# EasyEDA Pro project Clock2.eprj

# Schematic Schematic1
Board Name: Board1; Create Date: 2026-04-25; Page Name: P1; Project Name: Clock2; Schematic Name: Schematic1; Update Date: 2026-04-26; Company: EasyEDA.com; Page Size: A4; Version: V1.0
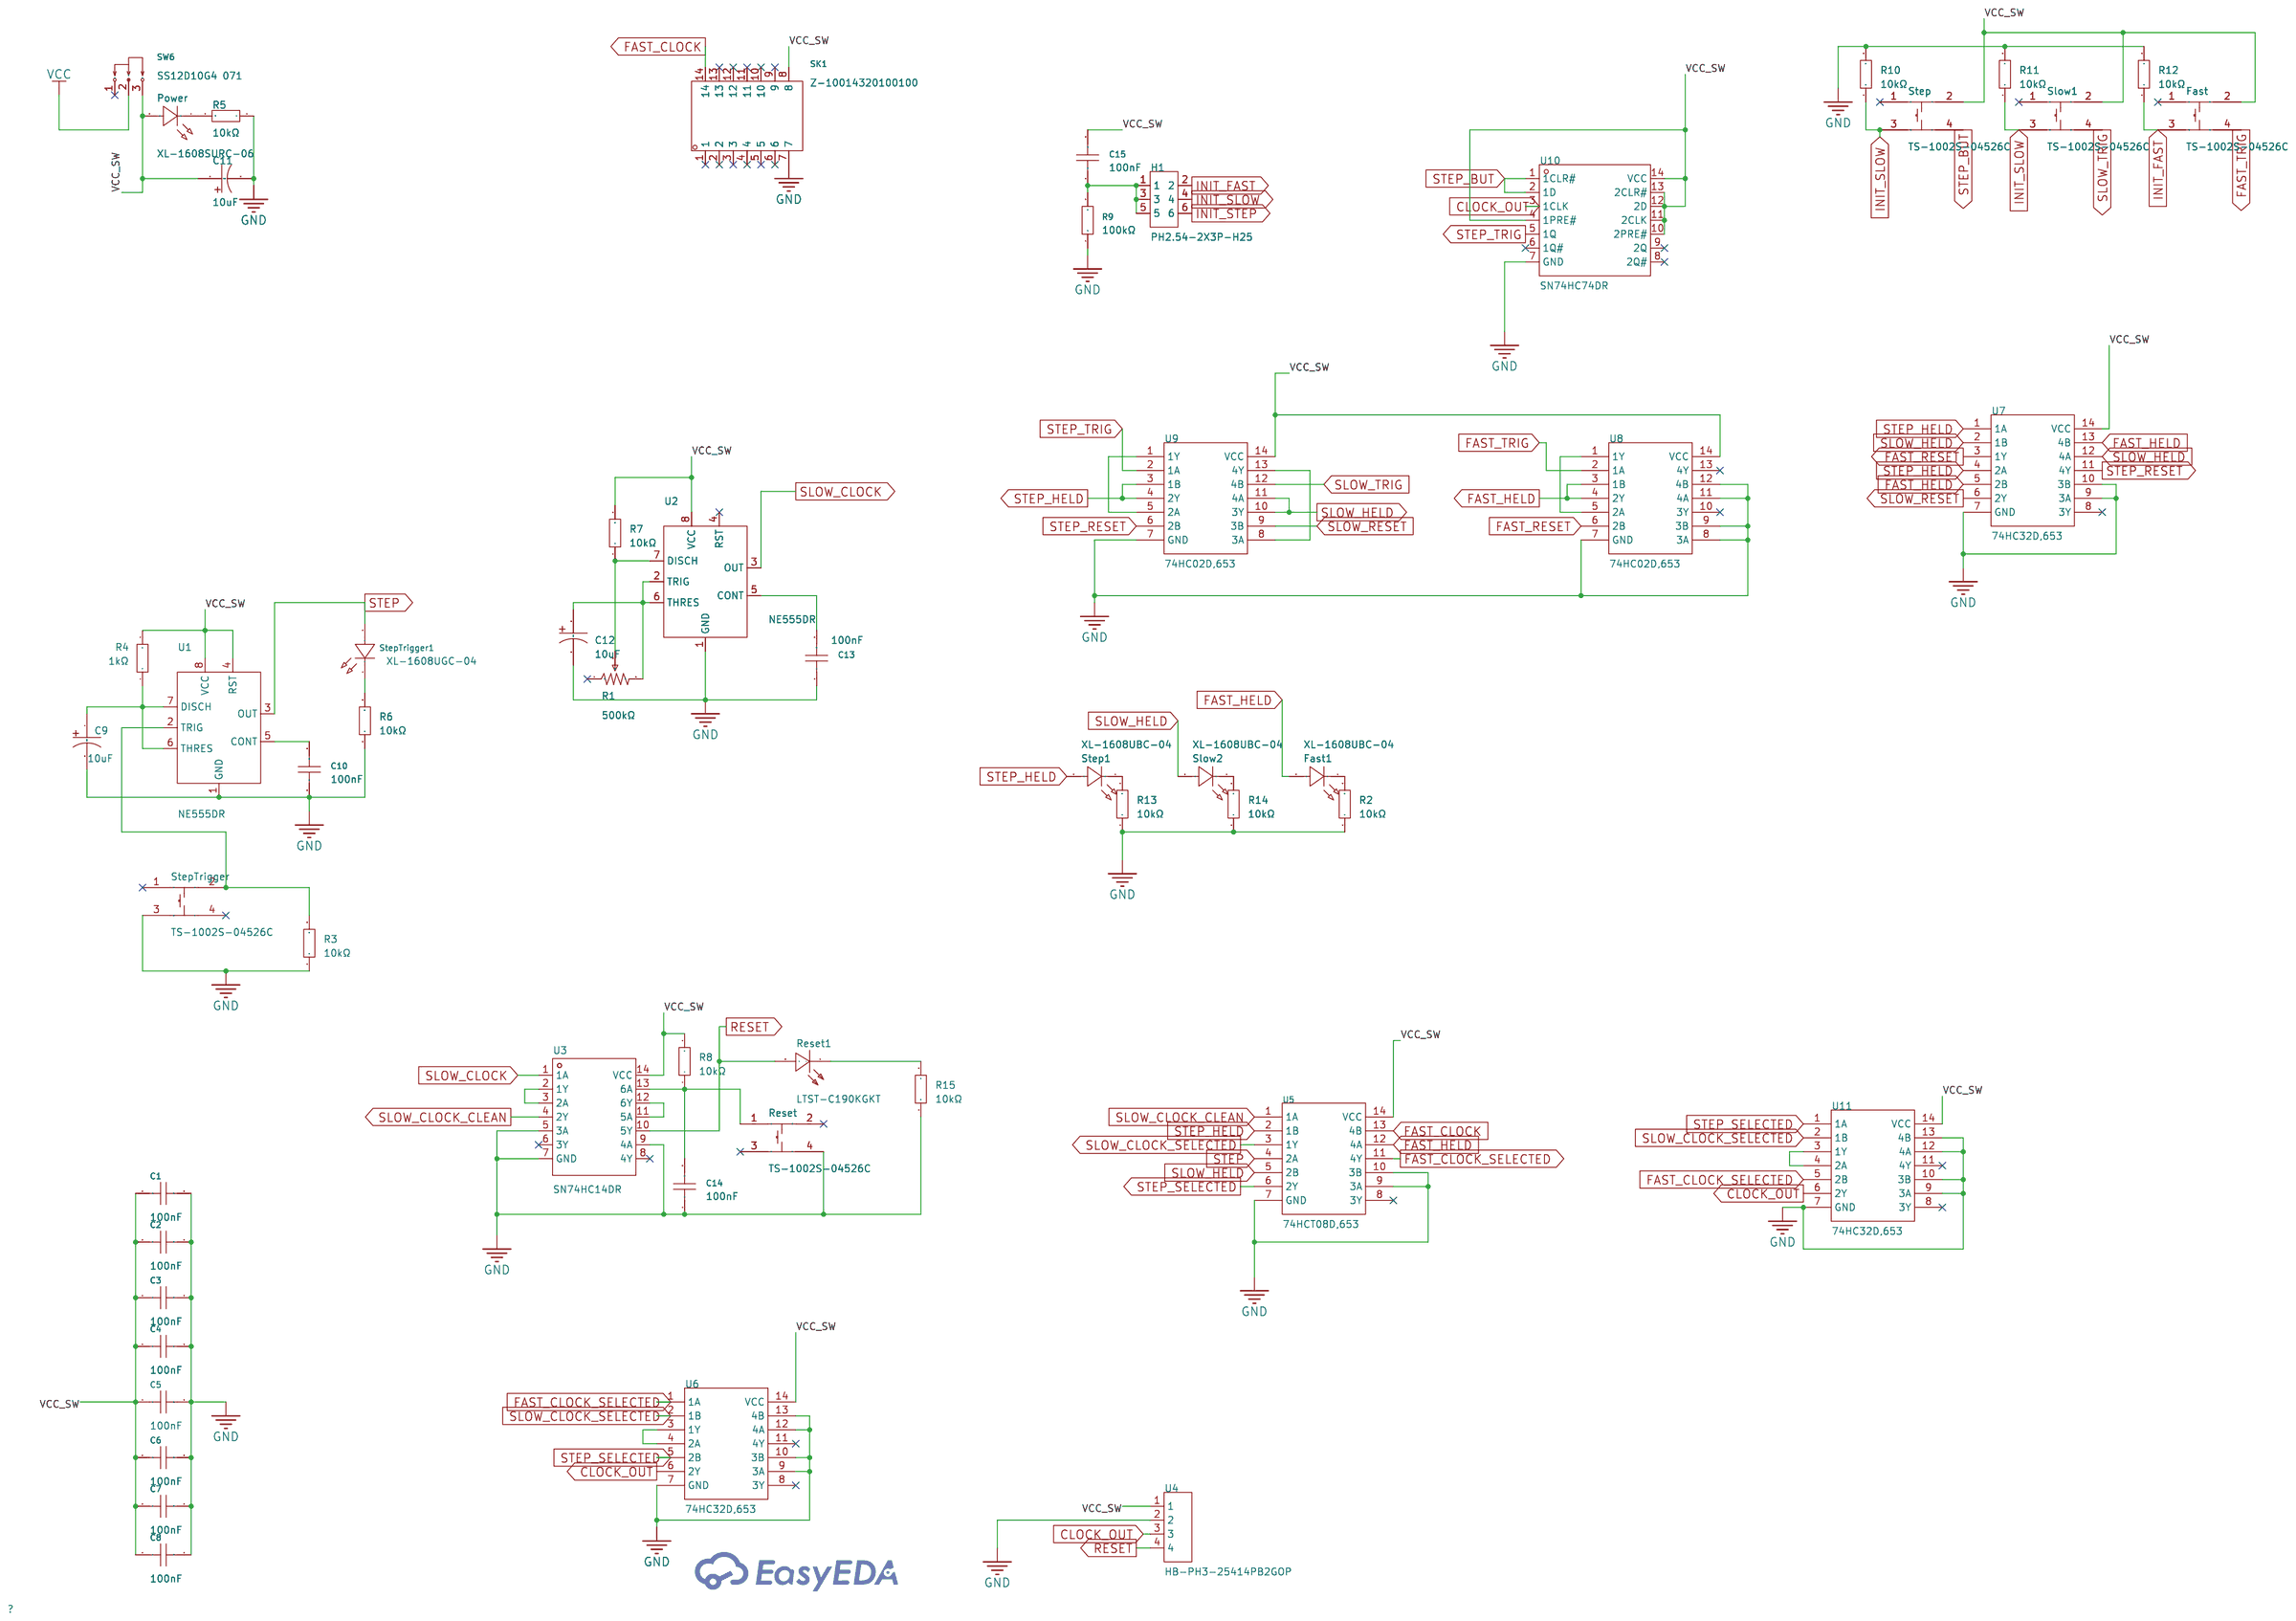
[diagram p0: schematic sheet]

## Parts
C1  100nF  [C0603]
C2  100nF  [C0603]
C3  100nF  [C0603]
C4  100nF  [C0603]
C5  100nF  [C0603]
C6  100nF  [C0603]
C7  100nF  [C0603]
C8  100nF  [C0603]
C9  10uF  [CAP-TH_BD4.0-P1.50-D0.8-FD]
C10  100nF  [C0603]
C11  10uF  [CAP-TH_BD4.0-P1.50-D0.8-FD]
C12  10uF  [CAP-TH_BD4.0-P1.50-D0.8-FD]
C13  100nF  [C0603]
C14  100nF  [C0603]
C15  100nF  [C0603]
Fast  TS-1002S-04526C  [SW-SMD_4P-L6.0-W6.0-P4.50-LS9.0-2]
Fast1  XL-1608UBC-04  [LED0603-RD_BLUE]
H1  PH2.54-2X3P-H25  [HDR-TH_6P-P2.54-V-M-R2-C3-S2.54-1]
Power  XL-1608SURC-06  [LED0603-RD_RED]
R1  500kΩ  [RES-ADJ-TH_3P-L9.5-W9.5-P2.54-BL_3386P-EY5-504LF]
R2  10kΩ  [R0603]
R3  10kΩ  [R0603]
R4  1kΩ  [R0603]
R5  10kΩ  [R0603]
R6  10kΩ  [R0603]
R7  10kΩ  [R0603]
R8  10kΩ  [R0603]
R9  100kΩ  [R0603]
R10  10kΩ  [R0603]
R11  10kΩ  [R0603]
R12  10kΩ  [R0603]
R13  10kΩ  [R0603]
R14  10kΩ  [R0603]
R15  10kΩ  [R0603]
Reset  TS-1002S-04526C  [SW-SMD_4P-L6.0-W6.0-P4.50-LS9.0-2]
Reset1  LTST-C190KGKT  [LED0603-RD]
SK1  Z-10014320100100  [DIP-14_L17.8-W10.2-P2.54-BL]
Slow1  TS-1002S-04526C  [SW-SMD_4P-L6.0-W6.0-P4.50-LS9.0-2]
Slow2  XL-1608UBC-04  [LED0603-RD_BLUE]
Step  TS-1002S-04526C  [SW-SMD_4P-L6.0-W6.0-P4.50-LS9.0-2]
Step1  XL-1608UBC-04  [LED0603-RD_BLUE]
StepTrigger  TS-1002S-04526C  [SW-SMD_4P-L6.0-W6.0-P4.50-LS9.0-2]
StepTrigger1  XL-1608UGC-04  [LED0603-RD_GREEN]
SW6  SS12D10G4 071  [SW-TH_SHOU-HAN_SS12D10G4]
U1  NE555DR  [SOIC-8_L4.9-W3.9-P1.27-LS6.0-BL]
U2  NE555DR  [SOIC-8_L4.9-W3.9-P1.27-LS6.0-BL]
U3  SN74HC14DR  [SOIC-14_L8.7-W3.9-P1.27-LS6.0-BL]
U4  HB-PH3-25414PB2GOP  [HDR-TH_4P-P2.54-V-M]
U5  74HCT08D,653  [SOIC-14_L8.7-W3.9-P1.27-LS6.0-BL]
U6  74HC32D,653  [SOIC-14_L8.7-W3.9-P1.27-LS6.0-BL]
U7  74HC32D,653  [SOIC-14_L8.7-W3.9-P1.27-LS6.0-BL]
U8  74HC02D,653  [SOIC-14_L8.7-W3.9-P1.27-LS6.0-BL]
U9  74HC02D,653  [SOIC-14_L8.7-W3.9-P1.27-LS6.0-BL]
U10  SN74HC74DR  [SOIC-14_L8.7-W3.9-P1.27-LS6.0-BL]
U11  74HC32D,653  [SOIC-14_L8.7-W3.9-P1.27-LS6.0-BL]

## Library data of the parts
C1-C8 C10 C13-C15 = CL10B104KB8NNNC: Capacitance:100nF Tolerance:±10% Tolerance:±10% Voltage Rating:50V Temperature Coefficient:X7R; LCSC Part Name: 100nF ±10% 50V; Supplier Part: C1591; Manufacturer: SAMSUNG(三星); Supplier Footprint: 0603; JLCPCB Part Class: Extended Part; Datasheet: https://item.szlcsc.com/datasheet/CL10B104KB8NNNC/1943.html; Supplier: LCSC; Tolerance: ±10%; Voltage Rating: 50V; Temperature Coefficient: X7R
C9 C11 C12 = KS1C100MB070A00CV0: Capacitance:10uF Tolerance:±20% Tolerance:±20% Voltage Rating:16V Ripple Current:24mA@120Hz Equivalent Series Resistance(ESR):- Pin Spacing:1.5mm Diameter:4mm Height - Seated (Max):7mm Lifetime:1000hrs@105℃; LCSC Part Name: 10uF ±20% 16V; Supplier Part: C216315; Manufacturer: HUAWEI(华威集团); Supplier Footprint: 插件,D4xL7mm; JLCPCB Part Class: Extended Part; Datasheet: https://item.szlcsc.com/datasheet/KS1C100MB070A00CV0/217222.html; Supplier: LCSC; Tolerance: ±20%; Voltage Rating: 16V; Ripple Current: 24mA@120Hz; Pin Spacing: 1.5mm; Diameter: 4mm; Height - Seated (Max): 7mm; Lifetime: 1000hrs@105℃
Fast Reset Slow1 Step StepTrigger = TS-1002S-04526C: Circuit:SPST Actuator Style:Round Button Operating Force:2.6N Mounting Type:Surface Mount,Vertical Length:6mm Width:6mm Switch Height:4.5mm with Bracket:Without Bracket Contact Current:50mA Voltage Rating:12V Actuator/Cap Color:Black With Lamp:- Terminati; LCSC Part Name: 6*6*4.5mm 立贴 轻触开关; Supplier Part: C455109; Manufacturer: XUNPU(讯普); Supplier Footprint: SMD-4P,6x6mm; JLCPCB Part Class: Extended Part; Datasheet: https://item.szlcsc.com/datasheet/TS-1002S-04526C/457514.html; Supplier: LCSC; Circuit: SPST; Actuator Style: Round Button; Operating Force: 2.6N; Mounting Type: Surface Mount,Vertical; Length: 6mm; Width: 6mm; Switch Height: 4.5mm; with Bracket: Without Bracket; Contact Current: 50mA; Voltage Rating: 12V; Actuator/Cap Color: Black; Termination Style: Gull Wing
Fast1 Slow2 Step1 = XL-1608UBC-04: Lamp Holder Type:- Illumination Color:Blue Voltage - Forward(Vf):3.3V Voltage - Forward(Vf):3.3V Power(Watts):70mW Forward Current:20mA Wavelength - Dominant:455nm~475nm Wavelength - Dominant:455nm~475nm Peak Wavelength:470nm Diode Configuration:Discrete; LCSC Part Name: 0603蓝色贴片式发光二极管; Supplier Part: C965807; Manufacturer: XINGLIGHT(成兴光); Supplier Footprint: 0603; JLCPCB Part Class: Extended Part; Datasheet: https://item.szlcsc.com/datasheet/XL-1608UBC-04/1051416.html; Supplier: LCSC; Illumination Color: Blue; Voltage - Forward(Vf): 3.3V; Power(Watts): 70mW; Forward Current: 20mA; Wavelength - Dominant: 455nm~475nm; Peak Wavelength: 470nm; Diode Configuration: Discrete Diode; Lens Color: Water Clear; Luminous Intensity: 300mcd; Viewing Angle: 120°; Mounting Style: Top-mount; Operating Temperature: -40℃~+85℃
H1 = PH2.54-2X3P-H25: Pin Structure:2x3P Pitch:2.54mm Row Spacing:2.54mm Circluar Pins/Square Pins:Pin Header Mounting Type:Through Hole Number of Rows:2 Number of Pins:6P Current Rating:3A Voltage Rating (Max):- Length of Mating Pin:6mm Insulation Height:2.5mm Length of End C; LCSC Part Name: 2x3P 间距:2.54mm 方针 直插; Supplier Part: C42431837; Manufacturer: JXTCONN(聚兴泰); Supplier Footprint: 插件,P=2.54mm; JLCPCB Part Class: Extended Part; Datasheet: https://item.szlcsc.com/datasheet/PH2.54-2X3P-H25/44458967.html; Supplier: LCSC; Pin Structure: 2x3P; Pitch: 2.54mm; Row Spacing: 2.54mm; Circluar Pins/Square Pins: Pin Header; Mounting Type: Through Hole; Number of Rows: 2; Number of Pins: 6P; Current Rating: 3A; Length of Mating Pin: 6mm; Insulation Height: 2.5mm; Length of End Connection Pin: 3mm; Contact Material: Brass; Contact Plating: Gold; Operating Temperature: -40℃~+105℃; Color: Black
Power = XL-1608SURC-06: Lamp Holder Type:- Illumination Color:Red Voltage - Forward(Vf):2.3V Voltage - Forward(Vf):2.3V Power(Watts):50mW Forward Current:20mA Wavelength - Dominant:620nm~630nm Wavelength - Dominant:620nm~630nm Peak Wavelength:625nm Diode Configuration:Discrete D; LCSC Part Name: 0603红色贴片式发光二极管; Supplier Part: C965799; Manufacturer: XINGLIGHT(成兴光); Supplier Footprint: 0603; JLCPCB Part Class: Extended Part; Datasheet: https://item.szlcsc.com/datasheet/XL-1608SURC-06/1051408.html; Supplier: LCSC; Illumination Color: Red; Voltage - Forward(Vf): 2.3V; Power(Watts): 50mW; Forward Current: 20mA; Wavelength - Dominant: 620nm~630nm; Peak Wavelength: 625nm; Diode Configuration: Discrete Diode; Lens Color: Water Clear; Luminous Intensity: 225mcd; Viewing Angle: 120°; Mounting Style: Top-mount; Operating Temperature: -40℃~+85℃
R1 = 3386P-EY5-504LF: Resistance:500kΩ Voltage Rating:- Power(Watts):500mW Number of Turns:-; Supplier Part: C2910038; Manufacturer: BOURNS; Supplier Footprint: 插件-3P,9.5x9.5mm; JLCPCB Part Class: Extended Part; Datasheet: https://item.szlcsc.com/datasheet/3386P-EY5-504LF/3189049.html; Supplier: LCSC; Power(Watts): 500mW
R2 R3 R5-R8 R10-R15 = RC0603FR-0710KL: Type:Thick Film Resistors Resistance: Tolerance:±1% Tolerance:±1% Power(Watts): Overload Voltage (Max): Temperature Coefficient:±100ppm/℃ Temperature Coefficient:±100ppm/℃ Operating Temperature Range:-55℃~+155℃ Operating Temperature Range:-55℃~+155℃; LCSC Part Name: 厚膜电阻 10kΩ ±1% 100mW; Supplier Part: C98220; Manufacturer: YAGEO(国巨); Supplier Footprint: 0603; JLCPCB Part Class: Extended Part; Datasheet: https://atta.szlcsc.com/upload/public/pdf/source/20180927/C295883_E8D83085EA81BD7DE0B2B681138C15EE.pdf; Supplier: LCSC; Type: Thick Film Resistors; Tolerance: ±1%; Temperature Coefficient: ±100ppm/℃; Operating Temperature Range: -55℃~+155℃
R4 = RC0603FR-071KL: Type:Thick Film Resistor Resistance:1kΩ Tolerance:±1% Tolerance:±1% Power(Watts):100mW Voltage-Supply(Max):75V Temperature Coefficient:±100ppm/℃ Temperature Coefficient:±100ppm/℃ Operating Temperature:-55℃~+155℃ Operating Temperature:-55℃~+155℃; LCSC Part Name: 厚膜电阻 1kΩ ±1% 100mW; Supplier Part: C22548; Manufacturer: YAGEO(国巨); Supplier Footprint: 0603; JLCPCB Part Class: Extended Part; Datasheet: https://item.szlcsc.com/datasheet/RC0603FR-071KL/23274.html; Supplier: LCSC; Type: Thick Film Resistor; Tolerance: ±1%; Power(Watts): 100mW; Voltage-Supply(Max): 75V; Temperature Coefficient: ±100ppm/℃; Operating Temperature: -55℃~+155℃
R9 = RC0603FR-07100KL: Type:Thick Film Resistors Resistance: Tolerance:±1% Tolerance:±1% Power(Watts): Overload Voltage (Max): Temperature Coefficient:±100ppm/℃ Temperature Coefficient:±100ppm/℃ Operating Temperature Range:-55℃~+155℃ Operating Temperature Range:-55℃~+155℃; LCSC Part Name: 厚膜电阻 100kΩ ±1% 100mW; Supplier Part: C14675; Manufacturer: YAGEO(国巨); Supplier Footprint: 0603; JLCPCB Part Class: Extended Part; Datasheet: https://atta.szlcsc.com/upload/public/pdf/source/20140324/1457707028752.pdf; Supplier: LCSC; Type: Thick Film Resistors; Tolerance: ±1%; Temperature Coefficient: ±100ppm/℃; Operating Temperature Range: -55℃~+155℃
Reset1 = LTST-C190KGKT: Lamp Holder Type:- Illumination Color:Yellow Green Voltage - Forward(Vf):2V Voltage - Forward(Vf):2V Power(Watts):75mW Forward Current:20mA Wavelength - Dominant:567.5nm~576.5nm Wavelength - Dominant:567.5nm~576.5nm Peak Wavelength:574nm Diode Configurati; LCSC Part Name: 普绿/黄绿; Supplier Part: C125094; Manufacturer: LITEON(光宝); Supplier Footprint: 0603; JLCPCB Part Class: Extended Part; Datasheet: https://item.szlcsc.com/datasheet/LTST-C190KGKT/136370.html; Supplier: LCSC; Illumination Color: Yellow Green; Voltage - Forward(Vf): 2V; Power(Watts): 75mW; Forward Current: 20mA; Wavelength - Dominant: 567.5nm~576.5nm; Peak Wavelength: 574nm; Diode Configuration: Discrete Diode; Lens Color: Water Clear; Luminous Intensity: 35mcd; Viewing Angle: 130°; Operating Temperature: -30℃~+85℃
SK1 = Z-10014320100100: Adaptation Package Type:DIP Pitch:2.54mm Row Spacing:7.62mm Circular Holes/Square Holes:Round Hole Number of Positions:14P Contact Material:Brass Contact Plating:Tin; LCSC Part Name: 间距2.54mm 圆孔 P数:14P; Supplier Part: C190815; Manufacturer: Nextron(正凌); Supplier Footprint: DIP-14; JLCPCB Part Class: Extended Part; Datasheet: https://item.szlcsc.com/datasheet/Z-10014320100100/213060.html; Supplier: LCSC; Adaptation Package Type: DIP; Pitch: 2.54mm; Row Spacing: 7.62mm; Circular Holes/Square Holes: Round Hole; Number of Positions: 14P; Contact Material: Brass; Contact Plating: Tin
StepTrigger1 = XL-1608UGC-04: Lamp Holder Type:- Illumination Color:Emerald Green Voltage - Forward(Vf):3.3V Voltage - Forward(Vf):3.3V Power(Watts):70mW Forward Current:20mA Wavelength - Dominant:515nm~535nm Wavelength - Dominant:515nm~535nm Peak Wavelength:525nm Diode Configuration:; LCSC Part Name: 0603翠绿贴片式发光二极管; Supplier Part: C965804; Manufacturer: XINGLIGHT(成兴光); Supplier Footprint: 0603; JLCPCB Part Class: Extended Part; Datasheet: https://item.szlcsc.com/datasheet/XL-1608UGC-04/1051413.html; Supplier: LCSC; Illumination Color: Emerald Green; Voltage - Forward(Vf): 3.3V; Power(Watts): 70mW; Forward Current: 20mA; Wavelength - Dominant: 515nm~535nm; Peak Wavelength: 525nm; Diode Configuration: Discrete Diode; Lens Color: Water Clear; Luminous Intensity: 810mcd; Viewing Angle: 120°; Mounting Style: Top-mount; Operating Temperature: -40℃~+85℃
SW6 = SS12D10G4 071: Circuit:SPDT Actuator Style:- Termination Style:PC Pin Length:12.7mm Width:6.7mm Switch Height:6.4mm Mounting Type:Through Hole Actuator Color:- Current Rating:2A Voltage Rating:125V Life:3,000 Cycles Operating Temperature:- Operating Temperature:-; LCSC Part Name: SS12D10G4-7.0脚长; Supplier Part: C2887259; Manufacturer: SHOU HAN(首韩); Supplier Footprint: 插件,12.7x6.7mm; JLCPCB Part Class: Extended Part; Datasheet: https://item.szlcsc.com/datasheet/SS12D10G4%2520071/3103827.html; Supplier: LCSC; Circuit: SPDT; Termination Style: PC Pin; Length: 12.7mm; Width: 6.7mm; Switch Height: 6.4mm; Mounting Type: Through Hole; Current Rating: 2A; Voltage Rating: 125V; Life: 3,000 Cycles
U1 U2 = NE555DR: Timer Number:1 Voltage - Supply:4.5V~16V Voltage - Supply:4.5V~16V Output Current:200mA Supply Current:2mA Operating Temperature:0℃~+70℃ Operating Temperature:0℃~+70℃ Features:占空比可调振荡；复位功能; LCSC Part Name: 精密定时器; Supplier Part: C7593; Manufacturer: TI(德州仪器); Supplier Footprint: SOIC-8; JLCPCB Part Class: Extended Part; Datasheet: https://www.ti.com/cn/lit/gpn/sa555; Supplier: LCSC; Timer Number: 1; Voltage - Supply: 4.5V~16V; Output Current: 200mA; Supply Current: 2mA; Operating Temperature: 0℃~+70℃; Features: 占空比可调振荡；复位功能
U3 = SN74HC14DR: Input Type:Schmitt trigger Voltage - Supply:2V~6V Voltage - Supply:2V~6V Quiescent Current(Iq):2uA Number of Circuits:6 Number of Inputs:1 Current - Output Low(IOL):5.2mA Current - Output High(IOH):5.2mA Input Logic Level - High:1.5V~4.2V Input Logic Leve; LCSC Part Name: 六路施密特触发反相器; Supplier Part: C6820; Manufacturer: TI(德州仪器); Supplier Footprint: SOIC-14; JLCPCB Part Class: Extended Part; Datasheet: https://www.ti.com/cn/lit/gpn/sn74hc14; Supplier: LCSC; Input Type: Schmitt trigger; Voltage - Supply: 2V~6V; Quiescent Current(Iq): 2uA; Number of Circuits: 6; Number of Inputs: 1; Current - Output Low(IOL): 5.2mA; Current - Output High(IOH): 5.2mA; Input Logic Level - High: 1.5V~4.2V; Input Logic Level -Low: 300mV~1.2V; Propagation Delay: 21ns@6V,50pF; Series: 74HC Series; Operating Temperature: -40℃~+85℃
U4 = HB-PH3-25414PB2GOP: Pin Structure:1x4P Pitch:2.54mm Row Spacing:2.54mm Circluar Pins/Square Pins:Policy Mounting Type:Straight Number of Rows:Single Row Number of Pins:4P Current Rating:3A Voltage Rating (Max):250V Length of Mating Pin:6mm Insulation Height:2.54mm Length of; LCSC Part Name: 1x4P 间距:2.54mm 方针 直插; Supplier Part: C6332197; Manufacturer: HANBO(汉博); Supplier Footprint: 插件,P=2.54mm; JLCPCB Part Class: Extended Part; Datasheet: https://atta.szlcsc.com/upload/public/pdf/source/20230803/F72D259687963761DF1B552F3BB84A31.pdf; Supplier: LCSC; Pin Structure: 1x4P; Pitch: 2.54mm; Row Spacing: 2.54mm; Circluar Pins/Square Pins: Policy; Mounting Type: Straight; Number of Rows: Single Row; Number of Pins: 4P; Current Rating: 3A; Voltage Rating (Max): 250V; Length of Mating Pin: 6mm; Insulation Height: 2.54mm; Length of End Connection Pin: 3mm; Contact Material: Brass; Contact Plating: Gold; Operating Temperature: -40℃~+105℃; Color: Black
U5 = 74HCT08D,653: Logic Type:AND Gate Number of Channels:4 Voltage - Supply:4.5V~5.5V Voltage - Supply:4.5V~5.5V Quiescent Current:2uA Current - Output Low(IOL):4mA Current - Output High(IOH):4mA Input Logic Level - High:2V Input Logic Level - High:2V Input Logic Level - L; LCSC Part Name: 四路二输入与门; Supplier Part: C5959; Manufacturer: Nexperia(安世); Supplier Footprint: SOIC-14; JLCPCB Part Class: Extended Part; Datasheet: https://item.szlcsc.com/datasheet/74HCT08D%252C653/6425.html; Supplier: LCSC; Logic Type: AND Gate; Number of Channels: 4; Voltage - Supply: 4.5V~5.5V; Quiescent Current: 2uA; Current - Output Low(IOL): 4mA; Current - Output High(IOH): 4mA; Input Logic Level - High: 2V; Input Logic Level - Low: 800mV; Series: 74HCT Series; Propagation Delay: 24ns@4.5V,50pF; Operating Temperature: -40℃~+125℃
U6 U7 U11 = 74HC32D,653: Logic Gate Type:ORGate Number of Channels:4 Supply Voltage:2V~6V Supply Voltage:2V~6V Quiescent Current (Max):2uA Sink Current:5.2mA Source Current:5.2mA High Level Range (VIH):1.5V~4.2V High Level Range (VIH):1.5V~4.2V Low Level Range (VIL):500mV~1.8V Lo; Supplier Part: C5632; Manufacturer: Nexperia(安世); Supplier Footprint: SOIC-14; JLCPCB Part Class: Extended Part; Datasheet: https://atta.szlcsc.com/upload/public/pdf/source/20120419/1457706475969.pdf; Supplier: LCSC; Logic Gate Type: ORGate; Number of Channels: 4; Supply Voltage: 2V~6V; Quiescent Current (Max): 2uA; Sink Current: 5.2mA; Source Current: 5.2mA; High Level Range (VIH): 1.5V~4.2V; Low Level Range (VIL): 500mV~1.8V; Series: 74HCSeries; Propagation Delay Time: 15ns@6V,50pF; Operating Temperature: -40℃~+125℃
U8 U9 = 74HC02D,653: Logic Type:NOR Gate Number of Channels:4 Voltage - Supply:2V~6V Voltage - Supply:2V~6V Quiescent Current:2uA Current - Output Low(IOL):5.2mA Current - Output High(IOH):5.2mA Input Logic Level - High:1.5V~4.2V Input Logic Level - High:1.5V~4.2V Input Logic; LCSC Part Name: 四路2输入或非门; Supplier Part: C5588; Manufacturer: Nexperia(安世); Supplier Footprint: SOIC-14; JLCPCB Part Class: Extended Part; Datasheet: https://item.szlcsc.com/datasheet/74HC02D%252C653/6039.html; Supplier: LCSC; Logic Type: NOR Gate; Number of Channels: 4; Voltage - Supply: 2V~6V; Quiescent Current: 2uA; Current - Output Low(IOL): 5.2mA; Current - Output High(IOH): 5.2mA; Input Logic Level - High: 1.5V~4.2V; Input Logic Level - Low: 500mV~1.8V; Output Logic Level - High: 5.9V；5.2V; Output Logic Level - Low: 400mV; Series: 74HC Series; Propagation Delay: 15ns@6V,50pF; Operating Temperature: -40℃~+125℃; Input Number: 2
U10 = SN74HC74DR: Type:D-Type Trigger Type:Rising Edge Voltage - Supply:2V~6V Voltage - Supply:2V~6V Clock Frequency:60MHz Function:Set and Reset Number of Elements:2 Number of Bits per Element:1 Output Type:Complementary Propagation Delay:15ns@6V,50pF Series:74HC Series C; LCSC Part Name: 双D型正边沿触发触发器，带清零和预置功能，工作电压范围2V至6V; Supplier Part: C6762; Manufacturer: TI(德州仪器); Supplier Footprint: SOIC-14; JLCPCB Part Class: Extended Part; Datasheet: https://www.ti.com/cn/lit/gpn/sn74hc74; Supplier: LCSC; Type: D-Type; Trigger Type: Rising Edge; Voltage - Supply: 2V~6V; Clock Frequency: 60MHz; Function: Set and Reset; Number of Elements: 2; Number of Bits per Element: 1; Output Type: Complementary; Propagation Delay: 15ns@6V,50pF; Series: 74HC Series; Current - Output Low(IOL): 5.2mA; Current - Output High(IOH): 5.2mA; Quiescent Current: 4uA; Input Capacitance: 3pF; Operating Temperature: -40℃~+85℃; Synchronous/Asynchronous: Asynchronous; Setup Time: 25ns; Hold Time: 0ns

## Nets
GND: C1.2 C2.2 C3.2 C4.2 C5.2 C6.2 C7.2 C8.2 C9.2 C10.1 C11.2 C12.2 C13.1 C14.1 R2.1 R3.1 R5.1 R6.1 R9.1 R10.2 R11.2 R12.2 R13.1 R14.1 R15.1 Reset.4 SK1.7 StepTrigger.3 U1.1(GND) U2.1(GND) U3.5(3A) U3.7(GND) U3.9(4A) U4.2 U5.7(GND) U5.9(3A) U5.10(3B) U6.7(GND) U6.9(3A) U6.10(3B) U6.12(4A) U6.13(4B) U7.7(GND) U7.9(3A) U7.10(3B) U8.7(GND) U8.8(3A) U8.9(3B) U8.11(4A) U8.12(4B) U9.7(GND) U10.7(GND) U11.7(GND) U11.9(3A) U11.10(3B) U11.12(4A) U11.13(4B)
VCC: SW6.2
VCC_SW: C1.1 C2.1 C3.1 C4.1 C5.1 C6.1 C7.1 C8.1 C11.1 C15.2 Fast.2 Power.2(A) R4.2 R7.2 R8.2 SK1.8 Slow1.2 Step.2 SW6.3 U1.4(RST) U1.8(VCC) U2.8(VCC) U3.14(VCC) U4.1 U5.14(VCC) U6.14(VCC) U7.14(VCC) U8.14(VCC) U9.14(VCC) U10.4(1PRE#) U10.10(2PRE#) U10.11(2CLK) U10.12(2D) U10.13(2CLR#) U10.14(VCC) U11.14(VCC)
CLOCK_OUT: U4.3 U6.6(2Y) U10.3(1CLK) U11.6(2Y)
FAST_CLOCK: SK1.14 U5.13(4B)
FAST_CLOCK_SELECTED: U5.11(4Y) U6.1(1A) U11.5(2B)
FAST_HELD: Fast1.2(A) U5.12(4A) U7.5(2B) U7.13(4B) U8.3(1B) U8.4(2Y)
FAST_RESET: U7.3(1Y) U8.6(2B)
FAST_TRIG: Fast.4 U8.2(1A)
INIT_FAST: Fast.3 H1.2 R12.1
INIT_SLOW: H1.4 R10.1 R11.1 Slow1.3 Step.3
INIT_STEP: H1.6
RESET: Reset1.2(+) U3.10(5Y) U4.4
SLOW_CLOCK: U2.3(OUT) U3.1(1A)
SLOW_CLOCK_CLEAN: U3.4(2Y) U5.1(1A)
SLOW_CLOCK_SELECTED: U5.3(1Y) U6.2(1B) U11.2(1B)
SLOW_HELD: Slow2.2(A) U5.5(2B) U7.2(1B) U7.12(4A) U9.10(3Y) U9.11(4A)
SLOW_RESET: U7.6(2Y) U9.9(3B)
SLOW_TRIG: Slow1.4 U9.12(4B)
STEP: StepTrigger1.2(A) U1.3(OUT) U5.4(2A)
STEP_BUT: Step.4 U10.1(1CLR#) U10.2(1D)
STEP_HELD: Step1.2(A) U5.2(1B) U7.1(1A) U7.4(2A) U9.3(1B) U9.4(2Y)
STEP_RESET: U7.11(4Y) U9.6(2B)
STEP_SELECTED: U5.6(2Y) U6.5(2B) U11.1(1A)
STEP_TRIG: U9.2(1A) U10.5(1Q)
$1N1836: R3.2 StepTrigger.2 U1.2(TRIG)
$1N1876: C9.1 R4.1 U1.6(THRES) U1.7(DISCH)
$1N2334: Power.1(K) R5.2
$1N2541: R6.2 StepTrigger1.1(K)
$1N2605: C12.1 R1.3(CW) U2.2(TRIG) U2.6(THRES)
$1N2789: C13.2 U2.5(CONT)
$1N2799: R1.2(WIPER) R7.1 U2.7(DISCH)
$1N3144: U3.2(1Y) U3.3(2A)
$1N3231: C14.2 R8.1 Reset.1 U3.13(6A)
$1N3302: U3.11(5A) U3.12(6Y)
$1N3637: C10.2 U1.5(CONT)
$1N4297: U6.3(1Y) U6.4(2A)
$1N5071: C15.1 H1.1 H1.3 H1.5 R9.2
$1N5847: R13.2 Step1.1(K)
$1N5849: R14.2 Slow2.1(K)
$1N5851: Fast1.1(K) R2.2
$1N5913: U9.1(1Y) U9.5(2A)
$1N6061: U9.8(3A) U9.13(4Y)
$1N6199: U8.1(1Y) U8.5(2A)
$1N6972: U11.3(1Y) U11.4(2A)
$1N7181: R15.2 Reset1.1(-)

Not connected (* = marked no-connect by the designer): Fast 1*; R1 1(CCW)*; Reset 2* 3*; SK1 1* 2* 3* 4* 5* 6* 9* 10* 11* 12* 13*; Slow1 1*; Step 1*; StepTrigger 1* 4*; SW6 1*; U2 4(RST)*; U3 6(3Y)* 8(4Y)*; U5 8(3Y)*; U6 8(3Y)* 11(4Y)*; U7 8(3Y)*; U8 10(3Y)* 13(4Y)*; U10 6(1Q#)* 8(2Q#)* 9(2Q)*; U11 8(3Y)* 11(4Y)*

# Board PCB1
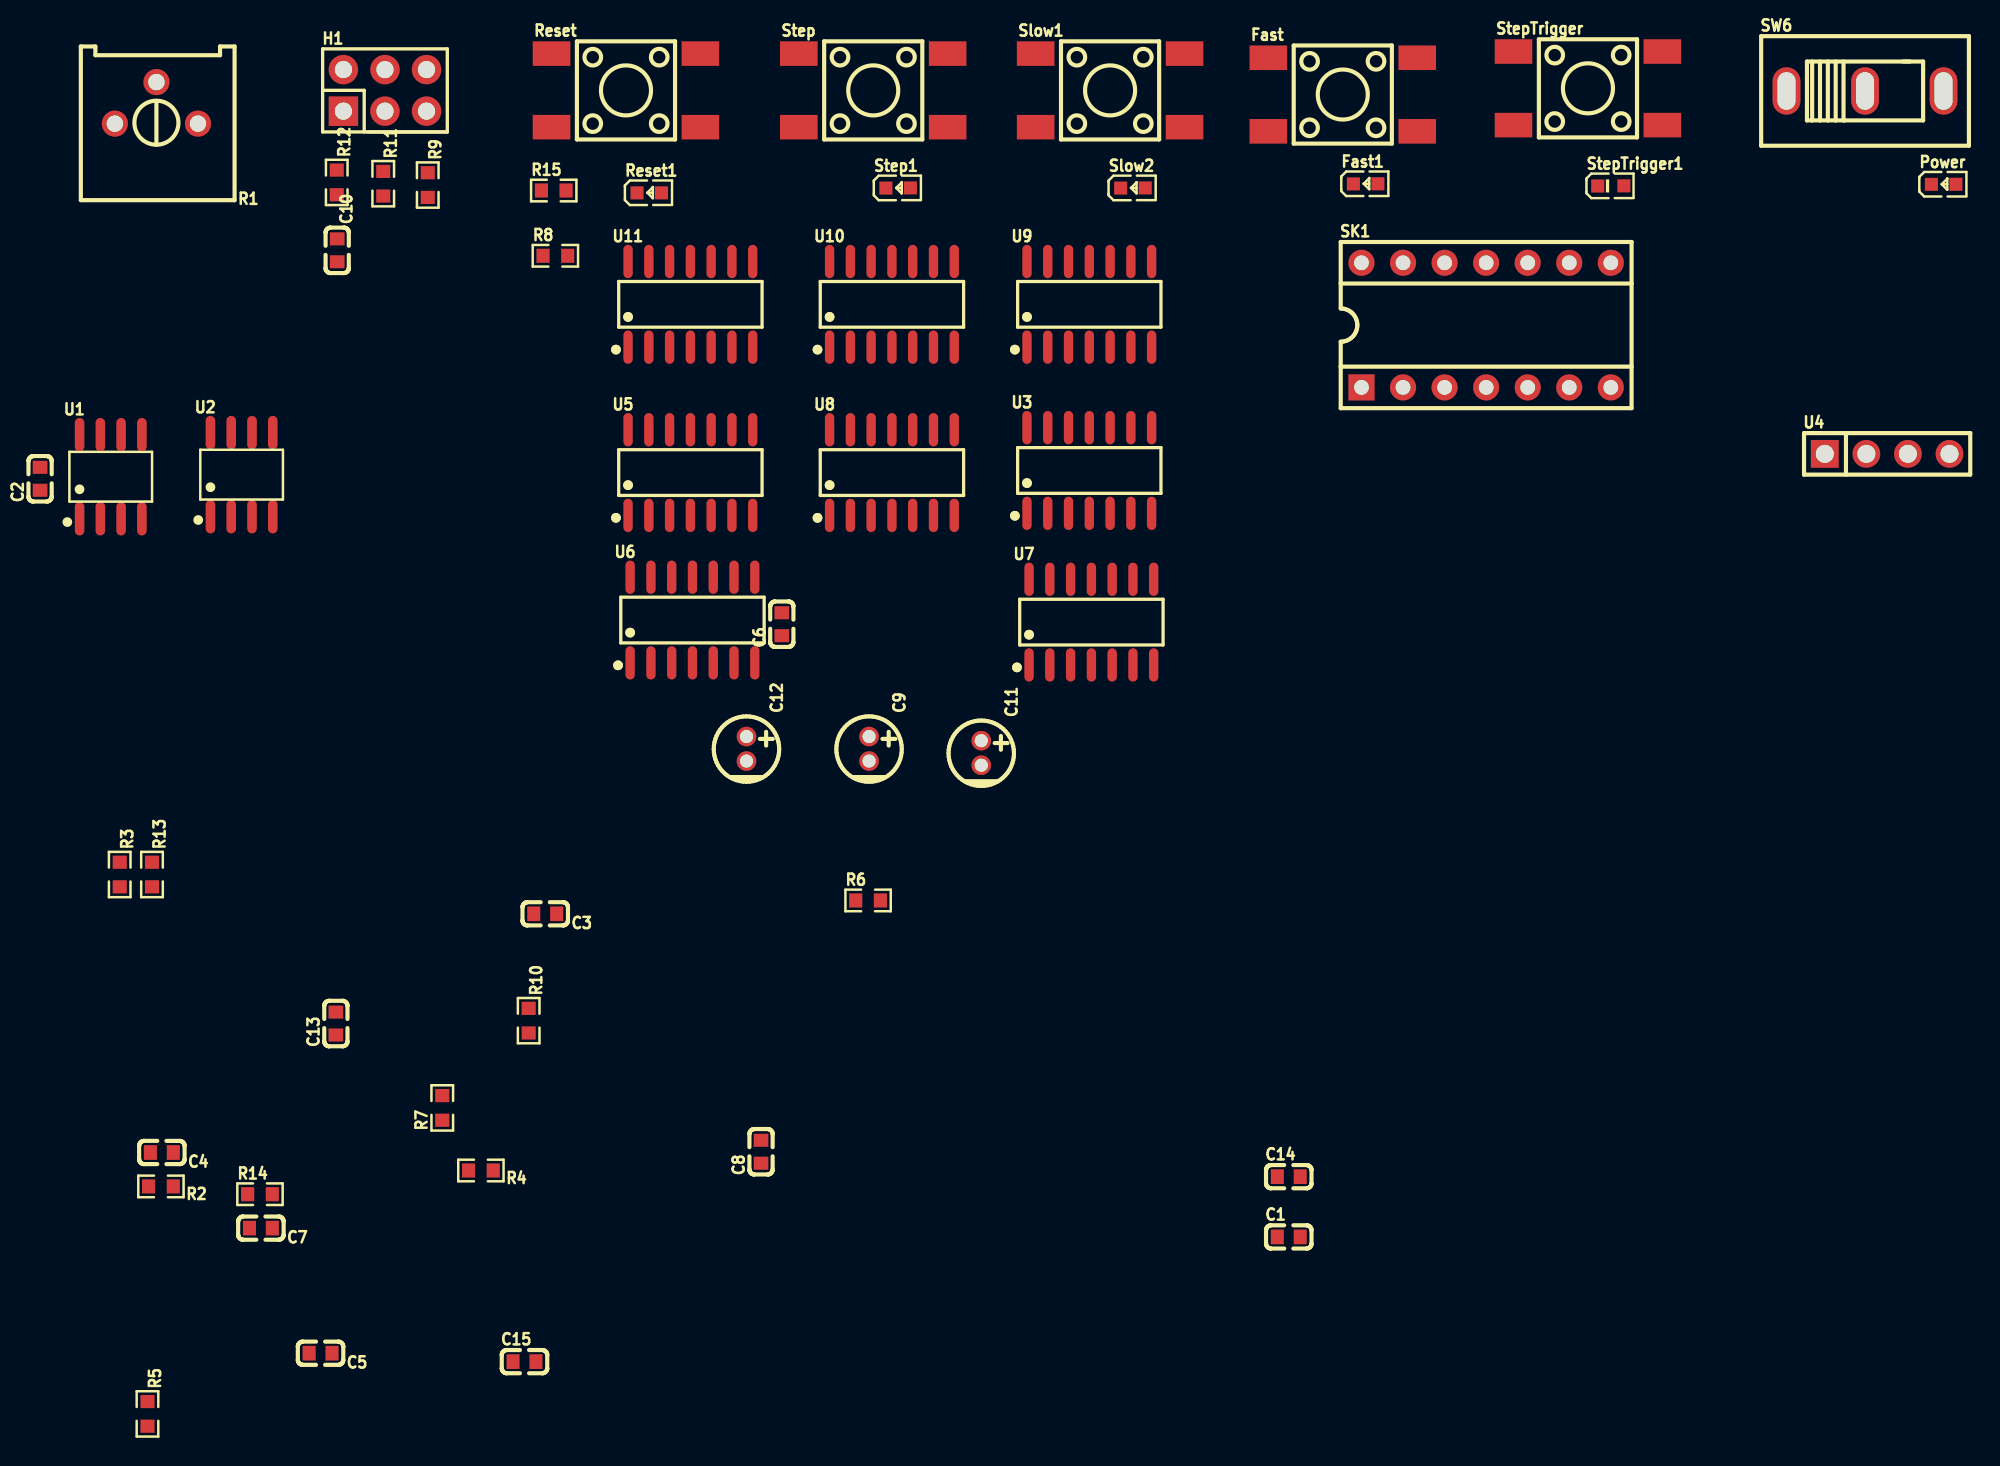
[diagram p1: board, top side]
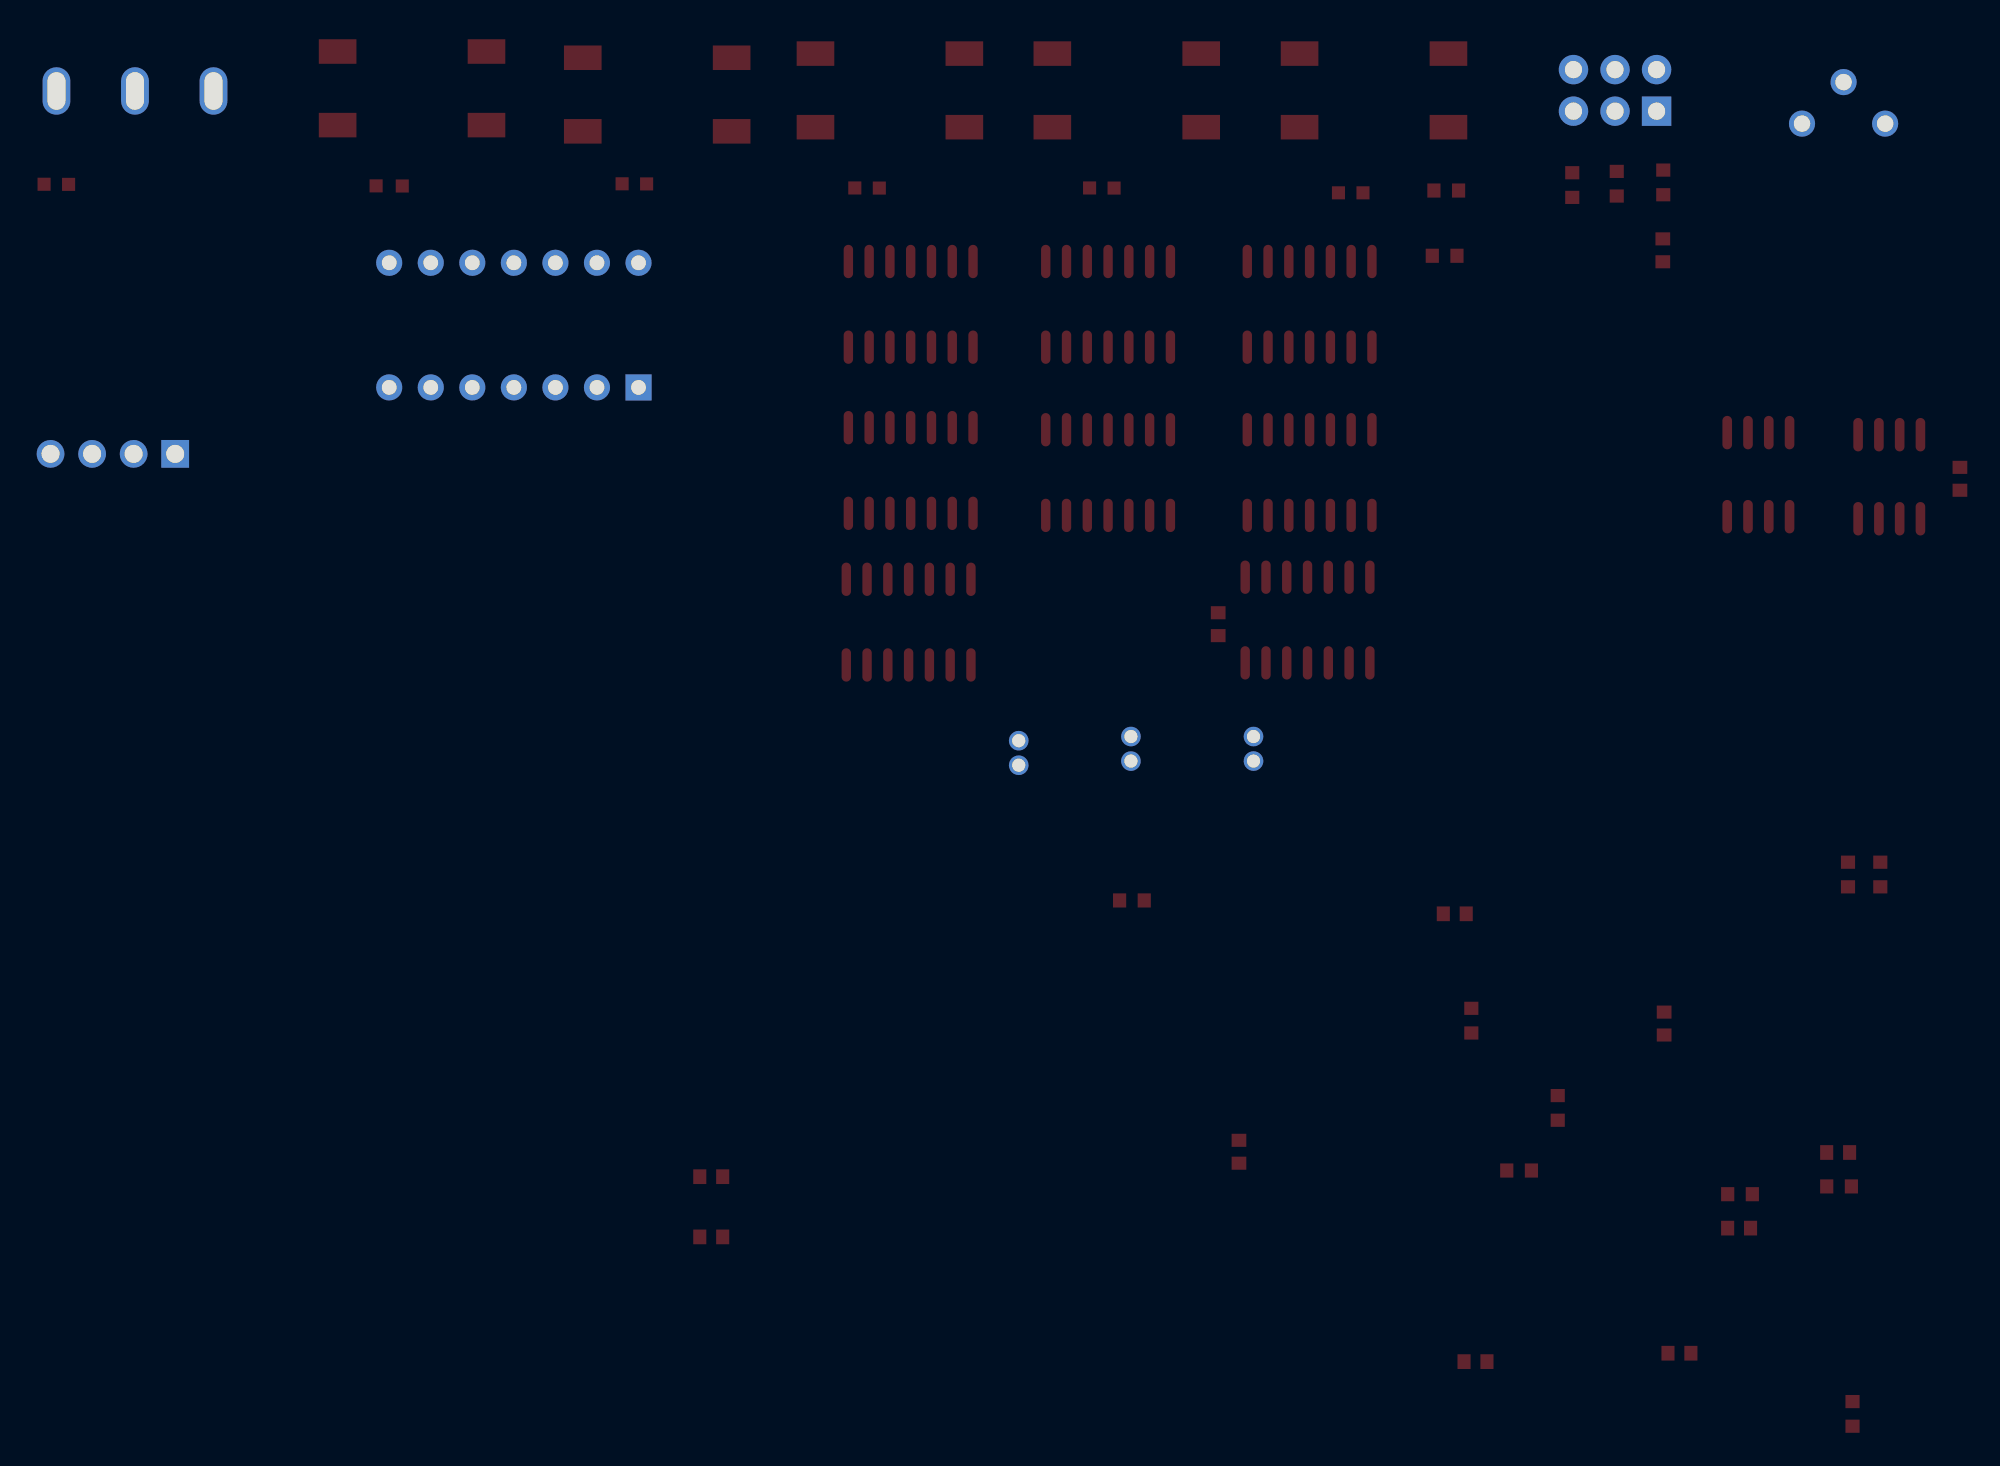
[diagram p2: board, bottom side, seen from below]

No outline. copper layers: Top Layer, Bottom Layer. Coordinates in mm from the lowest, leftmost part position.
Stack: Top Layer 0.035mm / Dielectric1 1.51mm FR4 er 4.5 / Bottom Layer 0.035mm

## Design rules (mm)
template: JLCPCB Capability(Two Layers Board)
spacing copperThickness1oz (default): track to track 0.102, other pairs 0.152 to 0.3
spacing copperThickness2oz: track to track 0.203, other pairs 0.152 to 0.3
track width copperThickness1oz (default): min 0.127, default 0.254, max 2.54
track width copperThickness2oz: min 0.203, default 0.254, max 2.54
differential pair differentialPair (default): width min 0.127, default 0.254, max 2.54; gap min 0.152, default 0.152
via viaSize (default): diameter min 0.5, default 0.61, max 10; hole min 0.3, default 0.305, max 6.3

## Placement (name value [footprint] x y rotation side)
C1  100nF  [C0603]  76.33 10.82 0 top
C2  100nF  [C0603]  0 57.18 90 top
C3  100nF  [C0603]  30.88 30.58 180 top
C4  100nF  [C0603]  7.44 15.98 180 top
C5  100nF  [C0603]  17.15 3.71 180 top
C6  100nF  [C0603]  45.34 48.29 90 top
C7  100nF  [C0603]  13.5 11.36 180 top
C8  100nF  [C0603]  44.07 16.03 90 top
C9  10uF  [CAP-TH_BD4.0-P1.50-D0.8-FD]  50.67 40.67 270 top
C10  100nF  [C0603]  18.16 71.15 270 top
C11  10uF  [CAP-TH_BD4.0-P1.50-D0.8-FD]  57.53 40.41 270 top
C12  10uF  [CAP-TH_BD4.0-P1.50-D0.8-FD]  43.18 40.67 270 top
C13  100nF  [C0603]  18.08 23.87 90 top
C14  100nF  [C0603]  76.33 14.5 0 top
C15  100nF  [C0603]  29.61 3.2 0 top
Fast  TS-1002S-04526C  [SW-SMD_4P-L6.0-W6.0-P4.50-LS9.0-2]  79.63 80.67 0 top
Fast1  XL-1608UBC-04  [LED0603-RD_BLUE]  81.03 75.21 0 top
H1  PH2.54-2X3P-H25  [HDR-TH_6P-P2.54-V-M-R2-C3-S2.54-1]  21.08 80.93 0 top
Power  XL-1608SURC-06  [LED0603-RD_RED]  116.36 75.18 0 top
R1  500kΩ  [RES-ADJ-TH_3P-L9.5-W9.5-P2.54-BL_3386P-EY5-504LF]  7.11 80.16 180 top
R2  10kΩ  [R0603]  7.39 13.91 180 top
R3  10kΩ  [R0603]  4.87 32.98 270 top
R4  1kΩ  [R0603]  26.95 14.88 180 top
R5  10kΩ  [R0603]  6.56 0 270 top
R6  10kΩ  [R0603]  50.61 31.4 0 top
R7  10kΩ  [R0603]  24.58 18.71 90 top
R8  10kΩ  [R0603]  31.5 70.81 0 top
R9  100kΩ  [R0603]  23.7 75.14 270 top
R10  10kΩ  [R0603]  29.87 24.05 270 top
R11  10kΩ  [R0603]  20.98 75.22 270 top
R12  10kΩ  [R0603]  18.13 75.3 270 top
R13  10kΩ  [R0603]  6.84 32.98 270 top
R14  10kΩ  [R0603]  13.44 13.43 0 top
R15  10kΩ  [R0603]  31.4 74.8 0 top
Reset  TS-1002S-04526C  [SW-SMD_4P-L6.0-W6.0-P4.50-LS9.0-2]  35.81 80.93 0 top
Reset1  LTST-C190KGKT  [LED0603-RD]  37.24 74.66 0 top
SK1  Z-10014320100100  [DIP-14_L17.8-W10.2-P2.54-BL]  88.39 66.57 0 top
Slow1  TS-1002S-04526C  [SW-SMD_4P-L6.0-W6.0-P4.50-LS9.0-2]  65.41 80.93 0 top
Slow2  XL-1608UBC-04  [LED0603-RD_BLUE]  66.8 74.96 0 top
Step  TS-1002S-04526C  [SW-SMD_4P-L6.0-W6.0-P4.50-LS9.0-2]  50.93 80.93 0 top
Step1  XL-1608UBC-04  [LED0603-RD_BLUE]  52.45 74.96 0 top
StepTrigger  TS-1002S-04526C  [SW-SMD_4P-L6.0-W6.0-P4.50-LS9.0-2]  94.62 81.05 0 top
StepTrigger1  XL-1608UGC-04  [LED0603-RD_GREEN]  96.01 75.08 0 top
SW6  SS12D10G4 071  [SW-TH_SHOU-HAN_SS12D10G4]  111.55 80.89 0 top
U1  NE555DR  [SOIC-8_L4.9-W3.9-P1.27-LS6.0-BL]  4.32 57.3 0 top
U2  NE555DR  [SOIC-8_L4.9-W3.9-P1.27-LS6.0-BL]  12.32 57.43 0 top
U3  SN74HC14DR  [SOIC-14_L8.7-W3.9-P1.27-LS6.0-BL]  64.13 57.69 0 top
U4  HB-PH3-25414PB2GOP  [HDR-TH_4P-P2.54-V-M]  112.9 58.7 0 top
U5  74HCT08D,653  [SOIC-14_L8.7-W3.9-P1.27-LS6.0-BL]  39.75 57.56 0 top
U6  74HC32D,653  [SOIC-14_L8.7-W3.9-P1.27-LS6.0-BL]  39.88 48.54 0 top
U7  74HC32D,653  [SOIC-14_L8.7-W3.9-P1.27-LS6.0-BL]  64.26 48.41 0 top
U8  74HC02D,653  [SOIC-14_L8.7-W3.9-P1.27-LS6.0-BL]  52.07 57.56 0 top
U9  74HC02D,653  [SOIC-14_L8.7-W3.9-P1.27-LS6.0-BL]  64.13 67.84 0 top
U10  SN74HC74DR  [SOIC-14_L8.7-W3.9-P1.27-LS6.0-BL]  52.07 67.84 0 top
U11  74HC32D,653  [SOIC-14_L8.7-W3.9-P1.27-LS6.0-BL]  39.75 67.84 0 top

## Footprints (pads in the part's own frame, mm; a bottom-side part is the same pattern mirrored in y, then rotated)
C0603
  rect 0.8x0.9 smd: 1(-0.7,0) 2(0.7,0)
CAP-TH_BD4.0-P1.50-D0.8-FD
  round 1.2 hole 0.8: 1(-0.75,0) 2(0.75,0)
DIP-14_L17.8-W10.2-P2.54-BL
  rect 1.6x1.6 hole 0.9: 1(-7.62,-3.81)
  round 1.6 hole 0.9: 2(-5.08,-3.81) 3(-2.54,-3.81) 4(0,-3.81) 5(2.54,-3.81) 6(5.08,-3.81) 7(7.62,-3.81) 8(7.62,3.81) 9(5.08,3.81) 10(2.54,3.81) 11(0,3.81) 12(-2.54,3.81) 13(-5.08,3.81) 14(-7.62,3.81)
HDR-TH_4P-P2.54-V-M
  rect 1.7x1.7 hole 1.1: 1(-3.81,0)
  round 1.7 hole 1.1: 2(-1.27,0) 3(1.27,0) 4(3.81,0)
HDR-TH_6P-P2.54-V-M-R2-C3-S2.54-1
  rect 1.8x1.8 hole 1.05: 1(-2.54,-1.27)
  round 1.8 hole 1.05: 2(-2.54,1.27) 3(0,-1.27) 4(0,1.27) 5(2.54,-1.27) 6(2.54,1.27)
LED0603-RD
  rect 0.8x0.8 smd: 1(-0.749,0) 2(0.749,0)
LED0603-RD_BLUE
  rect 0.8x0.8 smd: 1(-0.749,-0.004) 2(0.749,0.004)
LED0603-RD_GREEN
  rect 0.8x0.8 smd: 1(-0.799,-0.004) 2(0.799,0.004)
LED0603-RD_RED
  rect 0.8x0.8 smd: 1(-0.749,-0.004) 2(0.749,0.004)
R0603
  rect 0.806x0.864 smd: 1(-0.753,0) 2(0.753,0)
RES-ADJ-TH_3P-L9.5-W9.5-P2.54-BL_3386P-EY5-504LF
  round 1.6 hole 1: 1(-2.54,1.27) 2(0,-1.27) 3(2.54,1.27)
SOIC-8_L4.9-W3.9-P1.27-LS6.0-BL
  oval 0.588x2.045 smd: 1(-1.905,-2.57) 2(-0.635,-2.57) 3(0.635,-2.57) 4(1.905,-2.57) 5(1.905,2.57) 6(0.635,2.57) 7(-0.635,2.57) 8(-1.905,2.57)
SOIC-14_L8.7-W3.9-P1.27-LS6.0-BL
  oval 0.574x2.038 smd: 1(-3.81,-2.619) 2(-2.54,-2.619) 3(-1.27,-2.619) 4(0,-2.619) 5(1.27,-2.619) 6(2.54,-2.619) 7(3.81,-2.619) 8(3.81,2.619) 9(2.54,2.619) 10(1.27,2.619) 11(0,2.619) 12(-1.27,2.619) 13(-2.54,2.619) 14(-3.81,2.619)
SW-SMD_4P-L6.0-W6.0-P4.50-LS9.0-2
  rect 2.3x1.5 smd: 1(-4.55,2.25) 2(4.55,2.25) 3(-4.55,-2.25) 4(4.55,-2.25)
SW-TH_SHOU-HAN_SS12D10G4
  oval 1.7x2.9 hole 1.1x2.3: 1(-4.8,0) 2(0,0) 3(4.8,0)

## Nets
As in the schematic.

Pads without a net: Fast 1; R1 1; Reset 2 3; SK1 1 2 3 4 5 6 9 10 11 12 13; Slow1 1; Step 1; StepTrigger 1 4; SW6 1; U2 4; U3 6 8; U5 8; U6 8 11; U7 8; U8 10 13; U10 6 8 9; U11 8 11
